# Altium schematic sheet VoltageRegulator.SchDoc
size A4
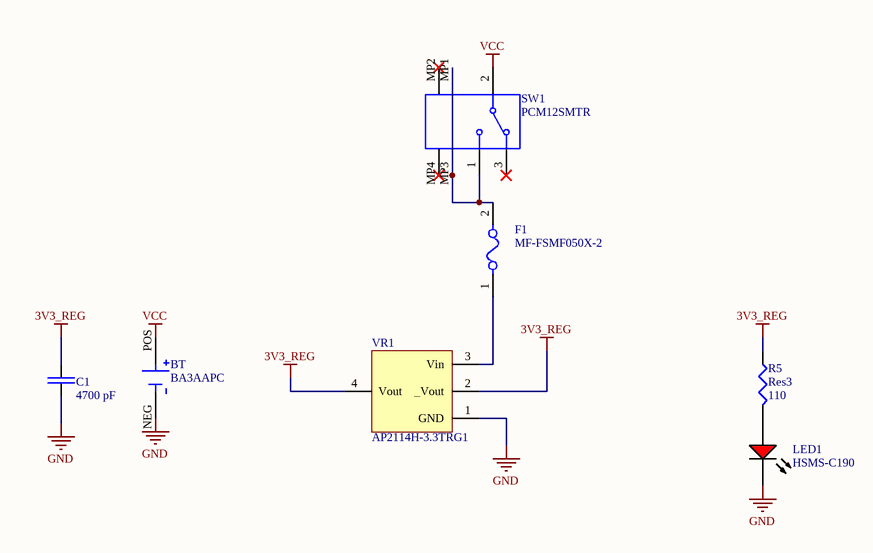
[diagram p0: VoltageRegulator.SchDoc]

## Parts
BT  BA3AAPC  [BAT_BA3AAPC  Slimmed down]
C1  4700 pF  [4700uF 0805]
F1  MF-FSMF050X-2  [FP-MF-FSMF-MFG]
LED1  HSMS-C190  [AVAG-HSMX-C190_V]
R5  Res3  value 110  [RESC1608X06N_0603]
SW1  PCM12SMTR  [CKCP-PCM12SMTR_V]
VR1  AP2114H-3.3TRG1  [AP2114]

## Nets
3V3_REG: C1.2 R5.1 VR1.2(_Vout) VR1.4(Vout)
GND: BT.NEG C1.1 LED1.2(K) VR1.1(GND)
VCC: BT.POS SW1.2
NetF1_1: F1.1 VR1.3(Vin)
NetF1_2: F1.2 SW1.1 SW1.MP1 SW1.MP3
NetLED1_1: LED1.1(A) R5.2

Not connected (* = marked no-connect by the designer): SW1 3* MP2* MP4*

## Library data of the parts
BT = BA3AAPC: Battery Holder _Open_ AA 3 Cell PC Pin; MF: MPD _Memory Protection Devices_; MP: BA3AAPC; Package: None; Value: *; Digi-Key_Purchase_URL: https://www.digikey.com/product-detail/en/mpd-memory-protection-devices/BA3AAPC/BA3AAPC-ND/2439223?utm_source=snapeda&utm_medium=aggregator&utm_campaign=symbol; Digi-Key_Part_Number: BA3AAPC-ND; SnapEDA_Link: https://www.snapeda.com/parts/BA3AAPC/MPD%20%28Memory%20Protection%20Devices%29/view-part/3213839/?ref=snap
C1 = 4700pF 0805: KEMET - C0805C472K5RACTU - CERAMIC CAPACITOR 4700PF, 50V, X7R, 10%, 0805; Capacitance: 4.7nF; Rule: UNIONINDEX=0|RULEKIND=Width|NETSCOPE=AnyNet|LAYERKIND=SameLayer|NAME=Schematic Width Constraint|MAXLIMIT=15mil|MINLIMIT=15mil|PREFEREDWIDTH=15mil|MIDLAYER1_MINWIDTH=10mil|MIDLAYER1_MAXWIDTH=10mil|MIDLAYER1_PREFWIDTH=10mil|MIDLAYER2_MINWIDTH=10mil|MIDLAYER2_MAXWIDTH=10mil|MIDLAYER2_PREFWIDTH=10mil|MIDLAYER3_MINWIDTH=10mil|MIDLAYER3_MAXWIDTH=10mil|MIDLAYER3_PREFWIDTH=10mil|MIDLAYER4_MINWIDTH=10mil|MIDLAYER4_MAXWIDTH=10mil|MIDLAYER4_PREFWIDTH=10mil|MIDLAYER5_MINWIDTH=10mil|MIDLAYER5_MAXWIDTH=10mil|MIDLAYER5_PREFWIDTH=10mil|MIDLAYER6_MINWIDTH=10mil|MIDLAYER6_MAXWIDTH=10mil|MIDLAYER6_PREFWIDTH=10mil|MIDLAYER7_MINWIDTH=10mil|MIDLAYER7_MAXWIDTH=10mil|MIDLAYER7_PREFWIDTH=10mil|MIDLAYER8_MINWIDTH=10mil|MIDLAYER8_MAXWIDTH=10mil|MIDLAYER8_PREFWIDTH=10mil|MIDLAYER9_MINWIDTH=10mil|MIDLAYER9_MAXWIDTH=10mil|MIDLAYER9_PREFWIDTH=10mil|MIDLAYER10_MINWIDTH=10mil|MIDLAYER10_MAXWIDTH=10mil|MIDLAYER10_PREFWIDTH=10mil|MIDLAYER11_MINWIDTH=10mil|MIDLAYER11_MAXWIDTH=10mil|MIDLAYER11_PREFWIDTH=10mil|MIDLAYER12_MINWIDTH=10mil|MIDLAYER12_MAXWIDTH=10mil|MIDLAYER12_PREFWIDTH=10mil|MIDLAYER13_MINWIDTH=10mil|MIDLAYER13_MAXWIDTH=10mil|MIDLAYER13_PREFWIDTH=10mil|MIDLAYER14_MINWIDTH=10mil|MIDLAYER14_MAXWIDTH=10mil|MIDLAYER14_PREFWIDTH=10mil|MIDLAYER15_MINWIDTH=10mil|MIDLAYER15_MAXWIDTH=10mil|MIDLAYER15_PREFWIDTH=10mil|MIDLAYER16_MINWIDTH=10mil|MIDLAYER16_MAXWIDTH=10mil|MIDLAYER16_PREFWIDTH=10mil|MIDLAYER17_MINWIDTH=10mil|MIDLAYER17_MAXWIDTH=10mil|MIDLAYER17_PREFWIDTH=10mil|MIDLAYER18_MINWIDTH=10mil|MIDLAYER18_MAXWIDTH=10mil|MIDLAYER18_PREFWIDTH=10mil|MIDLAYER19_MINWIDTH=10mil|MIDLAYER19_MAXWIDTH=10mil|MIDLAYER19_PREFWIDTH=10mil|MIDLAYER20_MINWIDTH=10mil|MIDLAYER20_MAXWIDTH=10mil|MIDLAYER20_PREFWIDTH=10mil|MIDLAYER21_MINWIDTH=10mil|MIDLAYER21_MAXWIDTH=10mil|MIDLAYER21_PREFWIDTH=10mil|MIDLAYER22_MINWIDTH=10mil|MIDLAYER22_MAXWIDTH=10mil|MIDLAYER22_PREFWIDTH=10mil|MIDLAYER23_MINWIDTH=10mil|MIDLAYER23_MAXWIDTH=10mil|MIDLAYER23_PREFWIDTH=10mil|MIDLAYER24_MINWIDTH=10mil|MIDLAYER24_MAXWIDTH=10mil|MIDLAYER24_PREFWIDTH=10mil|MIDLAYER25_MINWIDTH=10mil|MIDLAYER25_MAXWIDTH=10mil|MIDLAYER25_PREFWIDTH=10mil|MIDLAYER26_MINWIDTH=10mil|MIDLAYER26_MAXWIDTH=10mil|MIDLAYER26_PREFWIDTH=10mil|MIDLAYER27_MINWIDTH=10mil|MIDLAYER27_MAXWIDTH=10mil|MIDLAYER27_PREFWIDTH=10mil|MIDLAYER28_MINWIDTH=10mil|MIDLAYER28_MAXWIDTH=10mil|MIDLAYER28_PREFWIDTH=10mil|MIDLAYER29_MINWIDTH=10mil|MIDLAYER29_MAXWIDTH=10mil|MIDLAYER29_PREFWIDTH=10mil|MIDLAYER30_MINWIDTH=10mil|MIDLAYER30_MAXWIDTH=10mil|MIDLAYER30_PREFWIDTH=10mil|MINIMP=50.000000|MAXIMP=50.000000|FAVIMP=50.000000|UNIT=Imperial; Supplier 1: Digi-Key; Supplier Part Number 1: 399-1155-1-ND; Manufacturer 1: KEMET; Manufacturer Part Number 1: C0805C472K5RACTU; Stock 1: 374666; Pricing 1: 1=0,10000, 10=0,06800, 100=0,03040, 500=0,02172, 1000=0,01706 (USD); RoHS: Yes; Mount: Surface Mount; Case/Package: 0805; Number of Pins: 2; Weight: 0.000194oz; Dielectric Material: Ceramic; Contact Plating: Tin,Matte; Case Code (Imperial): 0805; Case Code (Metric): 2012; Min Operating Temperature: -55°C; Max Operating Temperature: 125°C; Tolerance: 10%; Packaging: Tape and Reel; Dielectric: X7R; Voltage Rating (DC): 50V; Package Quantity: 1; Voltage Rating: 50V; Termination: SMD/SMT; Voltage: 50V; Length: 2mm; Height: 0.78mm; Depth: 1.25mm; Width: 0.049inch; Thickness: 0.035inch; Radiation Hardening: No; REACH SVHC: No SVHC; ComponentLink1URL: https://datasheet.ciiva.com/6074/kem-c1002-x7r-smd-6074679.pdf?src-supplier=Farnell; ComponentLink1Description: https://datasheet.ciiva.com/6074/kem-c1002-x7r-smd-6074679.pdf?src-supplier=Farnell; ComponentLink2URL: https://datasheet.ciiva.com/28682/1851736-28682318.pdf?src-supplier=Element14; ComponentLink2Description: https://datasheet.ciiva.com/28682/1851736-28682318.pdf?src-supplier=Element14
F1 = CMP-07400-000010-1: PTC RESET FUSE 6V 500MA 0603; Manufacturer: Bourns Inc.; Trip Current: 1A; Current Rating: 40A; Hold Current: 0.5A; Resistance: 0.1-0.8Ω; Value: 0.1-0.8Ω; Trip Time: 0.1s; Mouser Description: Resettable Fuses - PPTC 6volts 40amps; Category: Fuse; Digikey Description: PTC RESET FUSE 6V 500MA 0603; Temperature: -40°C to +85°C; Device Class L3: unset; Automotive: No; RoHS: TRUE; Ambient Temperature Range High: +85°C; Device Class L2: PTC Resettable Fuses; Temperature Range High: +85°C; Voltage Rating: 6V; Package: MF-FSMF; Manufacturer Part Number: MF-FSMF050X-2; Ambient Temperature Range Low: -40°C; Lead Free: Yes; ComponentLink2Description: Datasheet; Octopart: https://octopart.com/mf-fsmf050x-2-bourns-10470804; ComponentLink2URL: https://www.bourns.com/docs/Product-Datasheets/mffsmf.pdf; Temperature Range Low: -40°C; Height: 1mm; Device Class L1: Circuit Protection
LED1 = CMP-2000-06427-1: LED Uni-Color Red, 52 mW, 20 mA, -40 to 85 degC, 2-Pin SMD, RoHS, Tape and Reel; Manufacturer: Avago; Reverse Voltage: 5V; Viewing Angle: 170deg; High Brightness: No; Lens Type: ColorlessDiffused; DELETED: Compliant; Product Height (mm): 0.8mm; Dominant Wave Length: 626nm; Number of  Elements: 1; Chip Material: GaP; Lum Intensity: 10mcd; Product Length (mm): 1.6mm; Forward Voltage: 2.6V; Power Dissipation: 52W; Shape Type: Rectangular; Forward Current: 25mA; Peak Wavelength: 630nm; Test Current (It): 20mA; Main Category: ChipLED; Lens Dimensions: 1x0.8x0.5mm; Pin Count: 2; Package Reference: HSMX-C190; Mounting Technology: SurfaceMount; Mounting: SurfaceMount; Datasheet URL: http://docs.avagotech.com/docs/AV02-0551EN; Package Type: ChipLed; Operating Temperature Classification: Industrial; Datasheet Version: 03/2012; Operating Temp Range: -40Cto85C; Emitting Color: Red; Rad Hardened: No; Manufacturer URL: http://www.avagotech.com/; Luminous Intensity: 10mcd; Package Description: 2-Pin Surface Mount Device, Body 1.6 x 0.8 mm, Height 0.9 mm; Type: Uni-Color; Packaging: TapeandReel; Product Depth (mm): 0.8mm
R5 = Res3: Resistor; Published: 8-Jun-2000; LatestRevisionDate: 29-May-2009; LatestRevisionNote: IPC-7351 Footprint Added.; PackageReference: J1-0603; Publisher: Altium Limited; PackageDescription: Chip Resistor
SW1 = CMP-2000-06884-1: Ultraminiature Slide Switch, SPDT, 0.3 A, 6 V, -20 to 85 degC, 3-Pin SMD, RoHS, Tape and Reel; Manufacturer: C&K Components; Switch Operation: On-On; Contact Current-Max: 0.3A; Datasheet Version: 02/2016; Package Reference: PCM12SMTR; Package Description: 3-Pin Surface Mount Device, Body 6.7 x 2.6 mm; Contact Material: SilverOverCopper; Mounting Technology: SurfaceMount; Circuitry: SPDT; Datasheet URL: http://www.ck-components.com/media/1424/pcm.pdf; Termination Style: RightAngle/SurfaceMount; Manufacturer URL: http://www.ckswitches.com/